# Altium schematic sheet SCH Pg1 Top Sheet.SchDoc: CZAR Power - Li-Ion Batt Brd BOT
size Letter; Organization: Adv Power Electronics Lab; Address1: Kettering University; Address2: 1700 University Ave; Address3: Flint, MI 48504; Address4: United States of America; DocumentNumber: 2; SheetNumber: 2; SheetTotal: 7
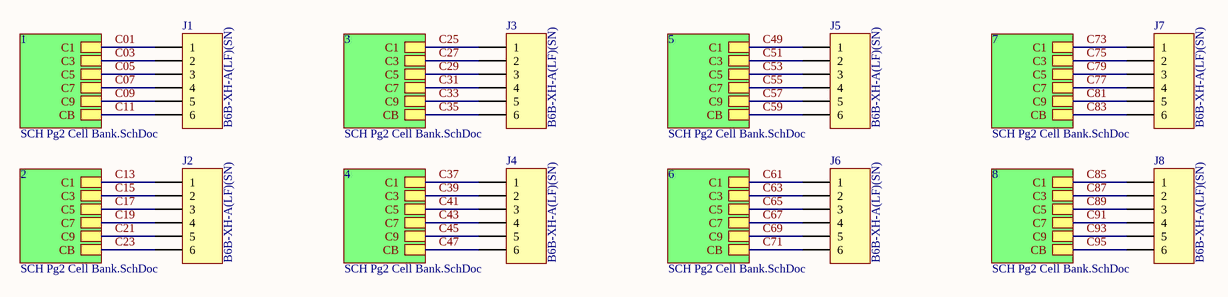
[diagram p0: SCH Pg1 Top Sheet.SchDoc]

## Parts
J1  B6B-XH-A(LF)(SN)  [JST-XH-B6]
J2  B6B-XH-A(LF)(SN)  [JST-XH-B6]
J3  B6B-XH-A(LF)(SN)  [JST-XH-B6]
J4  B6B-XH-A(LF)(SN)  [JST-XH-B6]
J5  B6B-XH-A(LF)(SN)  [JST-XH-B6]
J6  B6B-XH-A(LF)(SN)  [JST-XH-B6]
J7  B6B-XH-A(LF)(SN)  [JST-XH-B6]
J8  B6B-XH-A(LF)(SN)  [JST-XH-B6]

## Sub-sheets
1 = SCH Pg2 Cell Bank.SchDoc: C1, C3, C5, C7, C9, CB
2 = SCH Pg2 Cell Bank.SchDoc: C1, C3, C5, C7, C9, CB
3 = SCH Pg2 Cell Bank.SchDoc: C1, C3, C5, C7, C9, CB
4 = SCH Pg2 Cell Bank.SchDoc: C1, C3, C5, C7, C9, CB
5 = SCH Pg2 Cell Bank.SchDoc: C1, C3, C5, C7, C9, CB
6 = SCH Pg2 Cell Bank.SchDoc: C1, C3, C5, C7, C9, CB
7 = SCH Pg2 Cell Bank.SchDoc: C1, C3, C5, C7, C9, CB
8 = SCH Pg2 Cell Bank.SchDoc: C1, C3, C5, C7, C9, CB

## Nets
C01: J1.1 ; sheet 1/C1
C03: J1.2 ; sheet 1/C3
C05: J1.3 ; sheet 1/C5
C07: J1.4 ; sheet 1/C7
C09: J1.5 ; sheet 1/C9
C11: J1.6 ; sheet 1/CB
C13: J2.1 ; sheet 2/C1
C15: J2.2 ; sheet 2/C3
C17: J2.3 ; sheet 2/C5
C19: J2.4 ; sheet 2/C7
C21: J2.5 ; sheet 2/C9
C23: J2.6 ; sheet 2/CB
C25: J3.1 ; sheet 3/C1
C27: J3.2 ; sheet 3/C3
C29: J3.3 ; sheet 3/C5
C31: J3.4 ; sheet 3/C7
C33: J3.5 ; sheet 3/C9
C35: J3.6 ; sheet 3/CB
C37: J4.1 ; sheet 4/C1
C39: J4.2 ; sheet 4/C3
C41: J4.3 ; sheet 4/C5
C43: J4.4 ; sheet 4/C7
C45: J4.5 ; sheet 4/C9
C47: J4.6 ; sheet 4/CB
C49: J5.1 ; sheet 5/C1
C51: J5.2 ; sheet 5/C3
C53: J5.3 ; sheet 5/C5
C55: J5.4 ; sheet 5/C7
C57: J5.5 ; sheet 5/C9
C59: J5.6 ; sheet 5/CB
C61: J6.1 ; sheet 6/C1
C63: J6.2 ; sheet 6/C3
C65: J6.3 ; sheet 6/C5
C67: J6.4 ; sheet 6/C7
C69: J6.5 ; sheet 6/C9
C71: J6.6 ; sheet 6/CB
C73: J7.1 ; sheet 7/C1
C75: J7.2 ; sheet 7/C3
C77: J7.4 ; sheet 7/C7
C79: J7.3 ; sheet 7/C5
C81: J7.5 ; sheet 7/C9
C83: J7.6 ; sheet 7/CB
C85: J8.1 ; sheet 8/C1
C87: J8.2 ; sheet 8/C3
C89: J8.3 ; sheet 8/C5
C91: J8.4 ; sheet 8/C7
C93: J8.5 ; sheet 8/C9
C95: J8.6 ; sheet 8/CB

## Notes on the sheet
- Title
- Size:
- Date:
- Letter
- Number:
- Time:
- Revision:
- Sheet
- of
- File:

## Library data of the parts
J1-J8 = JST B6B-XH-A: Header, JST, 6-Pin, Straight; Supplier 1: Digi-Key; Supplier Part Number 1: 455-2271-ND; Category: J